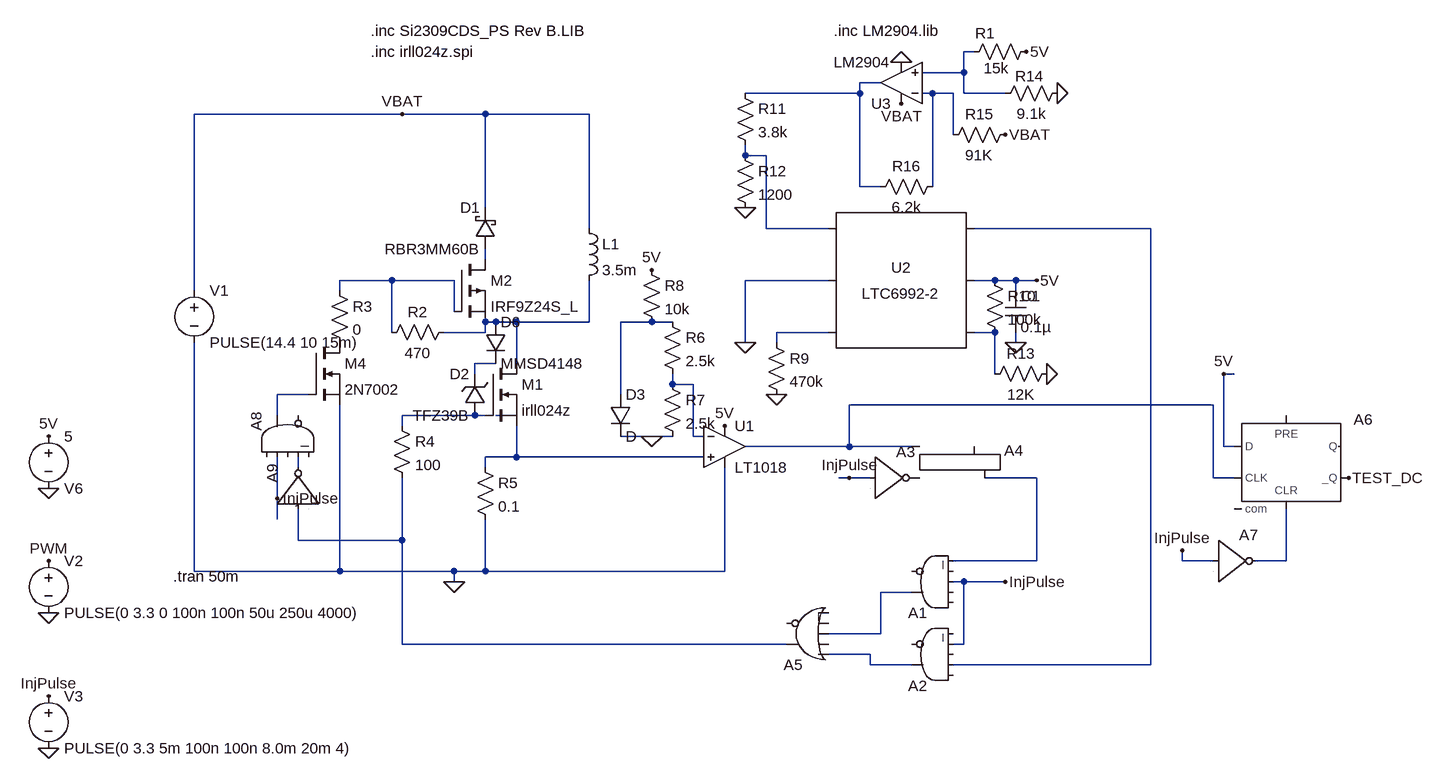
[diagram p0: schematic PWM low-z injector.asc]
PWM low-z injector.asc, the LTspice schematic file:
Version 4
SHEET 1 1828 1044
WIRE 944 -384 928 -384
WIRE 928 -352 928 -384
WIRE 928 -352 864 -352
WIRE 800 -336 768 -336
WIRE 768 -320 768 -336
WIRE 768 -320 592 -320
WIRE 880 -320 864 -320
WIRE 912 -320 880 -320
WIRE 928 -320 928 -352
WIRE 992 -320 928 -320
WIRE 64 -288 -256 -288
WIRE 192 -288 64 -288
WIRE 352 -288 192 -288
WIRE 912 -256 912 -320
WIRE 592 -224 592 -240
WIRE 624 -224 592 -224
WIRE 768 -176 768 -320
WIRE 800 -176 768 -176
WIRE 880 -176 880 -320
WIRE 192 -144 192 -288
WIRE 352 -112 352 -288
WIRE 624 -112 624 -224
WIRE 720 -112 624 -112
WIRE 1216 -112 944 -112
WIRE 192 -64 192 -80
WIRE 48 -32 -32 -32
WIRE 144 -32 48 -32
WIRE 720 -32 592 -32
WIRE 976 -32 944 -32
WIRE 1008 -32 976 -32
WIRE 1040 -32 1008 -32
WIRE -256 -16 -256 -288
WIRE -32 -16 -32 -32
WIRE 1008 -16 1008 -32
WIRE 144 16 144 -32
WIRE 208 32 192 32
WIRE 240 32 208 32
WIRE 352 32 352 -32
WIRE 352 32 240 32
WIRE 448 32 400 32
WIRE 480 32 448 32
WIRE 48 48 48 -32
WIRE 192 48 192 32
WIRE 192 48 128 48
WIRE 720 48 640 48
WIRE 976 48 944 48
WIRE 592 64 592 -32
WIRE 640 64 640 48
WIRE 1008 64 1008 48
WIRE 208 96 176 96
WIRE 240 96 240 32
WIRE 176 112 176 96
WIRE 976 112 976 48
WIRE 1344 112 1328 112
WIRE 480 128 480 112
WIRE 512 128 480 128
WIRE -80 144 -128 144
WIRE 400 144 400 32
WIRE 1312 160 752 160
WIRE -128 176 -128 144
WIRE 176 176 64 176
WIRE 192 176 176 176
WIRE 240 176 208 176
WIRE 64 192 64 176
WIRE 448 208 400 208
WIRE 480 208 448 208
WIRE 512 208 512 128
WIRE 528 208 512 208
WIRE 752 224 752 160
WIRE 752 224 592 224
WIRE 848 224 752 224
WIRE 1328 224 1328 112
WIRE 1344 224 1328 224
WIRE 240 240 240 192
WIRE 240 240 192 240
WIRE 528 240 240 240
WIRE -96 256 -96 240
WIRE 192 256 192 240
WIRE 752 272 736 272
WIRE 784 272 752 272
WIRE 1040 272 960 272
WIRE 1312 272 1312 160
WIRE 1344 272 1312 272
WIRE -128 304 -128 240
WIRE -128 336 -128 304
WIRE -96 368 -96 320
WIRE 64 368 64 272
WIRE 64 368 -96 368
WIRE 1040 400 1040 272
WIRE 1040 400 912 400
WIRE 1264 400 1264 384
WIRE 1312 400 1264 400
WIRE 1424 400 1424 320
WIRE 1424 400 1376 400
WIRE -256 416 -256 64
WIRE -32 416 -32 160
WIRE -32 416 -256 416
WIRE 144 416 -32 416
WIRE 192 416 192 336
WIRE 192 416 144 416
WIRE 560 416 560 256
WIRE 560 416 192 416
WIRE 144 432 144 416
WIRE 928 432 912 432
WIRE 992 432 928 432
WIRE 848 448 800 448
WIRE 800 512 800 448
WIRE 800 512 720 512
WIRE 64 528 64 368
WIRE 656 528 64 528
WIRE 928 528 928 432
WIRE 928 528 912 528
WIRE 784 544 720 544
WIRE 784 560 784 544
WIRE 848 560 784 560
WIRE 1216 560 1216 -112
WIRE 1216 560 912 560
FLAG 144 432 0
FLAG -480 288 0
FLAG -480 608 InjPulse
FLAG 752 272 InjPulse
FLAG -480 688 0
FLAG -128 304 InjPulse
FLAG -480 480 0
FLAG -480 400 PWM
FLAG 992 432 InjPulse
FLAG -480 208 5V
FLAG 560 192 5V
FLAG 448 -48 5V
FLAG 448 208 0
FLAG 592 64 0
FLAG 1040 -32 5V
FLAG 1008 64 0
FLAG 640 144 0
FLAG 1328 112 5V
FLAG 1520 272 TEST_DC
FLAG 1264 384 InjPulse
FLAG 64 -288 VBAT
FLAG 1072 -320 0
FLAG 1024 -384 5V
FLAG 992 -256 VBAT
FLAG 832 -368 0
FLAG 832 -304 VBAT
FLAG 592 -144 0
FLAG 1056 112 0
SYMBOL ind 336 -128 R0
SYMATTR InstName L1
SYMATTR Value 3.5m
SYMATTR SpiceLine Ipk=10A Rser=2
SYMBOL voltage -256 -32 R0
WINDOW 123 0 0 Left 2
WINDOW 39 0 0 Left 2
SYMATTR InstName V1
SYMATTR Value PULSE(14.4 10 15m)
SYMBOL res 144 32 R90
WINDOW 0 0 56 VBottom 2
WINDOW 3 32 56 VTop 2
SYMATTR InstName R2
SYMATTR Value 470
SYMBOL res -48 -32 R0
SYMATTR InstName R3
SYMATTR Value 0
SYMBOL voltage -480 384 R0
WINDOW 123 0 0 Left 2
WINDOW 39 0 0 Left 2
SYMATTR InstName V2
SYMATTR Value PULSE(0 3.3 0 100n 100n 50u 250u 4000)
SYMBOL voltage -480 592 R0
WINDOW 123 0 0 Left 2
WINDOW 39 0 0 Left 2
SYMATTR InstName V3
SYMATTR Value PULSE(0 3.3 5m 100n 100n 8.0m 20m 4)
SYMBOL schottky 208 -80 R180
WINDOW 0 24 64 Left 2
WINDOW 3 24 0 Left 2
SYMATTR InstName D1
SYMATTR Value RBR3MM60B
SYMATTR Description Diode
SYMATTR Type diode
SYMBOL res 48 176 R0
SYMATTR InstName R4
SYMATTR Value 100
SYMBOL res 176 240 R0
SYMATTR InstName R5
SYMATTR Value 0.1
SYMBOL Comparators\\LT1018 560 224 R0
SYMATTR InstName U1
SYMBOL voltage -480 192 R0
WINDOW 0 24 96 Left 2
WINDOW 3 24 16 Left 2
WINDOW 123 0 0 Left 2
WINDOW 39 0 0 Left 2
SYMATTR InstName V6
SYMATTR Value 5
SYMBOL Digital\\inv 784 208 R0
SYMATTR InstName A3
SYMATTR SpiceLine Vhigh=3.3V
SYMBOL Digital\\srflop 896 176 R0
SYMATTR InstName A4
SYMATTR SpiceLine Vhigh=3.3V
SYMBOL Digital\\and 880 496 R180
SYMATTR InstName A1
SYMATTR SpiceLine Vhigh=3.3V
SYMBOL Digital\\and 880 608 R180
SYMATTR InstName A2
SYMATTR SpiceLine Vhigh=3.3V
SYMBOL Digital\\or 688 576 R180
SYMATTR InstName A5
SYMATTR SpiceLine Vhigh=5V
SYMBOL diode 384 144 R0
SYMATTR InstName D3
SYMBOL res 464 16 R0
SYMATTR InstName R6
SYMATTR Value 2.5k
SYMBOL res 464 112 R0
SYMATTR InstName R7
SYMATTR Value 2.5k
SYMBOL res 432 -64 R0
SYMATTR InstName R8
SYMATTR Value 10k
SYMBOL SpecialFunctions\\LTC6992-2 832 -32 R0
SYMATTR InstName U2
SYMBOL cap 992 -16 R0
SYMATTR InstName C1
SYMATTR Value 0.1µ
SYMBOL res 624 48 R0
SYMATTR InstName R9
SYMATTR Value 470k
SYMBOL res 960 -48 R0
SYMATTR InstName R10
SYMATTR Value 100k
SYMBOL res 576 -336 R0
SYMATTR InstName R11
SYMATTR Value 3.8k
SYMBOL res 576 -240 R0
SYMATTR InstName R12
SYMATTR Value 1200
SYMBOL Digital\\dflop 1424 176 R0
SYMATTR InstName A6
SYMBOL Digital\\inv 1312 336 R0
SYMATTR InstName A7
SYMATTR SpiceLine Vhigh=3.3V
SYMBOL nmos 192 96 R0
SYMATTR InstName M1
SYMATTR Value irll024z
SYMATTR Prefix X
SYMBOL zener 192 176 R180
WINDOW 0 24 64 Left 2
WINDOW 3 24 0 Left 2
SYMATTR InstName D2
SYMATTR Value TFZ39B
SYMATTR Description Diode
SYMATTR Type diode
SYMBOL diode 192 32 R0
SYMATTR InstName D6
SYMATTR Value MMSD4148
SYMBOL Digital\\and -176 208 R270
SYMATTR InstName A8
SYMATTR SpiceLine Vhigh=5V
SYMBOL Digital\\inv -160 320 R270
SYMATTR InstName A9
SYMATTR SpiceLine Vhigh=3.3V
SYMBOL res 1040 -400 R90
WINDOW 0 3 79 VBottom 2
WINDOW 3 26 62 VTop 2
SYMATTR InstName R1
SYMATTR Value 15k
SYMBOL res 1088 -336 R90
WINDOW 0 5 59 VBottom 2
WINDOW 3 32 56 VTop 2
SYMATTR InstName R14
SYMATTR Value 9.1k
SYMBOL res 1008 -272 R90
WINDOW 0 0 56 VBottom 2
WINDOW 3 32 56 VTop 2
SYMATTR InstName R15
SYMATTR Value 91K
SYMATTR SpiceLine tol=1 pwr=0.1
SYMBOL res 896 -192 R90
WINDOW 0 0 56 VBottom 2
WINDOW 3 32 56 VTop 2
SYMATTR InstName R16
SYMATTR Value 6.2k
SYMBOL res 1072 96 R90
WINDOW 0 0 56 VBottom 2
WINDOW 3 32 56 VTop 2
SYMATTR InstName R13
SYMATTR Value 12K
SYMBOL Opamps\\opamp2 832 -272 R180
SYMATTR InstName U3
SYMATTR Value LM2904
SYMBOL nmos -80 64 R0
SYMATTR InstName M4
SYMATTR Value 2N7002
SYMBOL pmos 144 -64 R0
SYMATTR InstName M2
SYMATTR Value IRF9Z24S_L
TEXT -288 424 Left 2 !.tran 50m
TEXT 728 -416 Left 2 !.inc LM2904.lib
TEXT 16 -416 Left 2 !.inc Si2309CDS_PS Rev B.LIB
TEXT 16 -384 Left 2 !.inc irll024z.spi

The netlist it stands for:
* PWM low-z injector.asc
L1 VBAT N008 3.5m Ipk=10A Rser=2
V1 VBAT 0 PULSE(14.4 10 15m)
R2 N008 N007 470
R3 N007 P001 0
V2 PWM 0 PULSE(0 3.3 0 100n 100n 50u 250u 4000)
V3 InjPulse 0 PULSE(0 3.3 5m 100n 100n 8.0m 20m 4)
D1 N006 VBAT RBR3MM60B
R4 N016 N021 100
R5 N018 0 0.1
XU1 N018 N013 5V 0 N015 LT1018  ; pins In+ In- V+ V- OUT
V6 5V 0 5
A3 InjPulse 0 0 0 0 P002 0 0 BUF Vhigh=3.3V
A4 N015 P002 0 0 0 N020 0 0 SRFLOP Vhigh=3.3V
A1 0 0 InjPulse 0 N020 0 N023 0 AND Vhigh=3.3V
A2 0 N005 0 InjPulse 0 0 N024 0 AND Vhigh=3.3V
A5 N024 0 N023 0 0 0 N021 0 OR Vhigh=5V
D3 N009 0 D
R6 N009 N013 2.5k
R7 N013 0 2.5k
R8 5V N009 10k
XU2 N004 0 N010 N011 5V N005 LTC6992-2
C1 5V 0 0.1µ
R9 N010 0 470k
R10 5V N011 100k
R11 N002 N004 3.8k
R12 N004 0 1200
A6 5V 0 N015 0 N022 TEST_DC 0 0 DFLOP
A7 InjPulse 0 0 0 0 N022 0 0 BUF Vhigh=3.3V
XM1 N008 N016 N018 irll024z  ; pins D G S
D2 N016 N012 TFZ39B
D6 N008 N012 MMSD4148
A8 0 InjPulse 0 N019 0 0 N014 0 AND Vhigh=5V
A9 N021 0 0 0 0 N019 0 0 BUF Vhigh=3.3V
R1 5V N001 15k
R14 0 N001 9.1k
R15 VBAT N003 91K tol=1 pwr=0.1
R16 N003 N002 6.2k
R13 0 N011 12K
XU3 N001 N003 VBAT 0 N002 LM2904  ; pins In+ In- V+ V- OUT
M4 P001 N014 0 0 2N7002
M2 N006 N007 N008 N008 IRF9Z24S_L
.model D D
.lib standard.dio
.model NMOS NMOS
.model PMOS PMOS
.lib standard.mos
.tran 50m
.inc LM2904.lib
.inc Si2309CDS_PS Rev B.LIB
.inc irll024z.spi
.lib LTC1.lib
.lib LTC6992-2.sub
.backanno
.end